# Altium project PA_8CH_CTRL.PrjPcb (part 1 of 3)
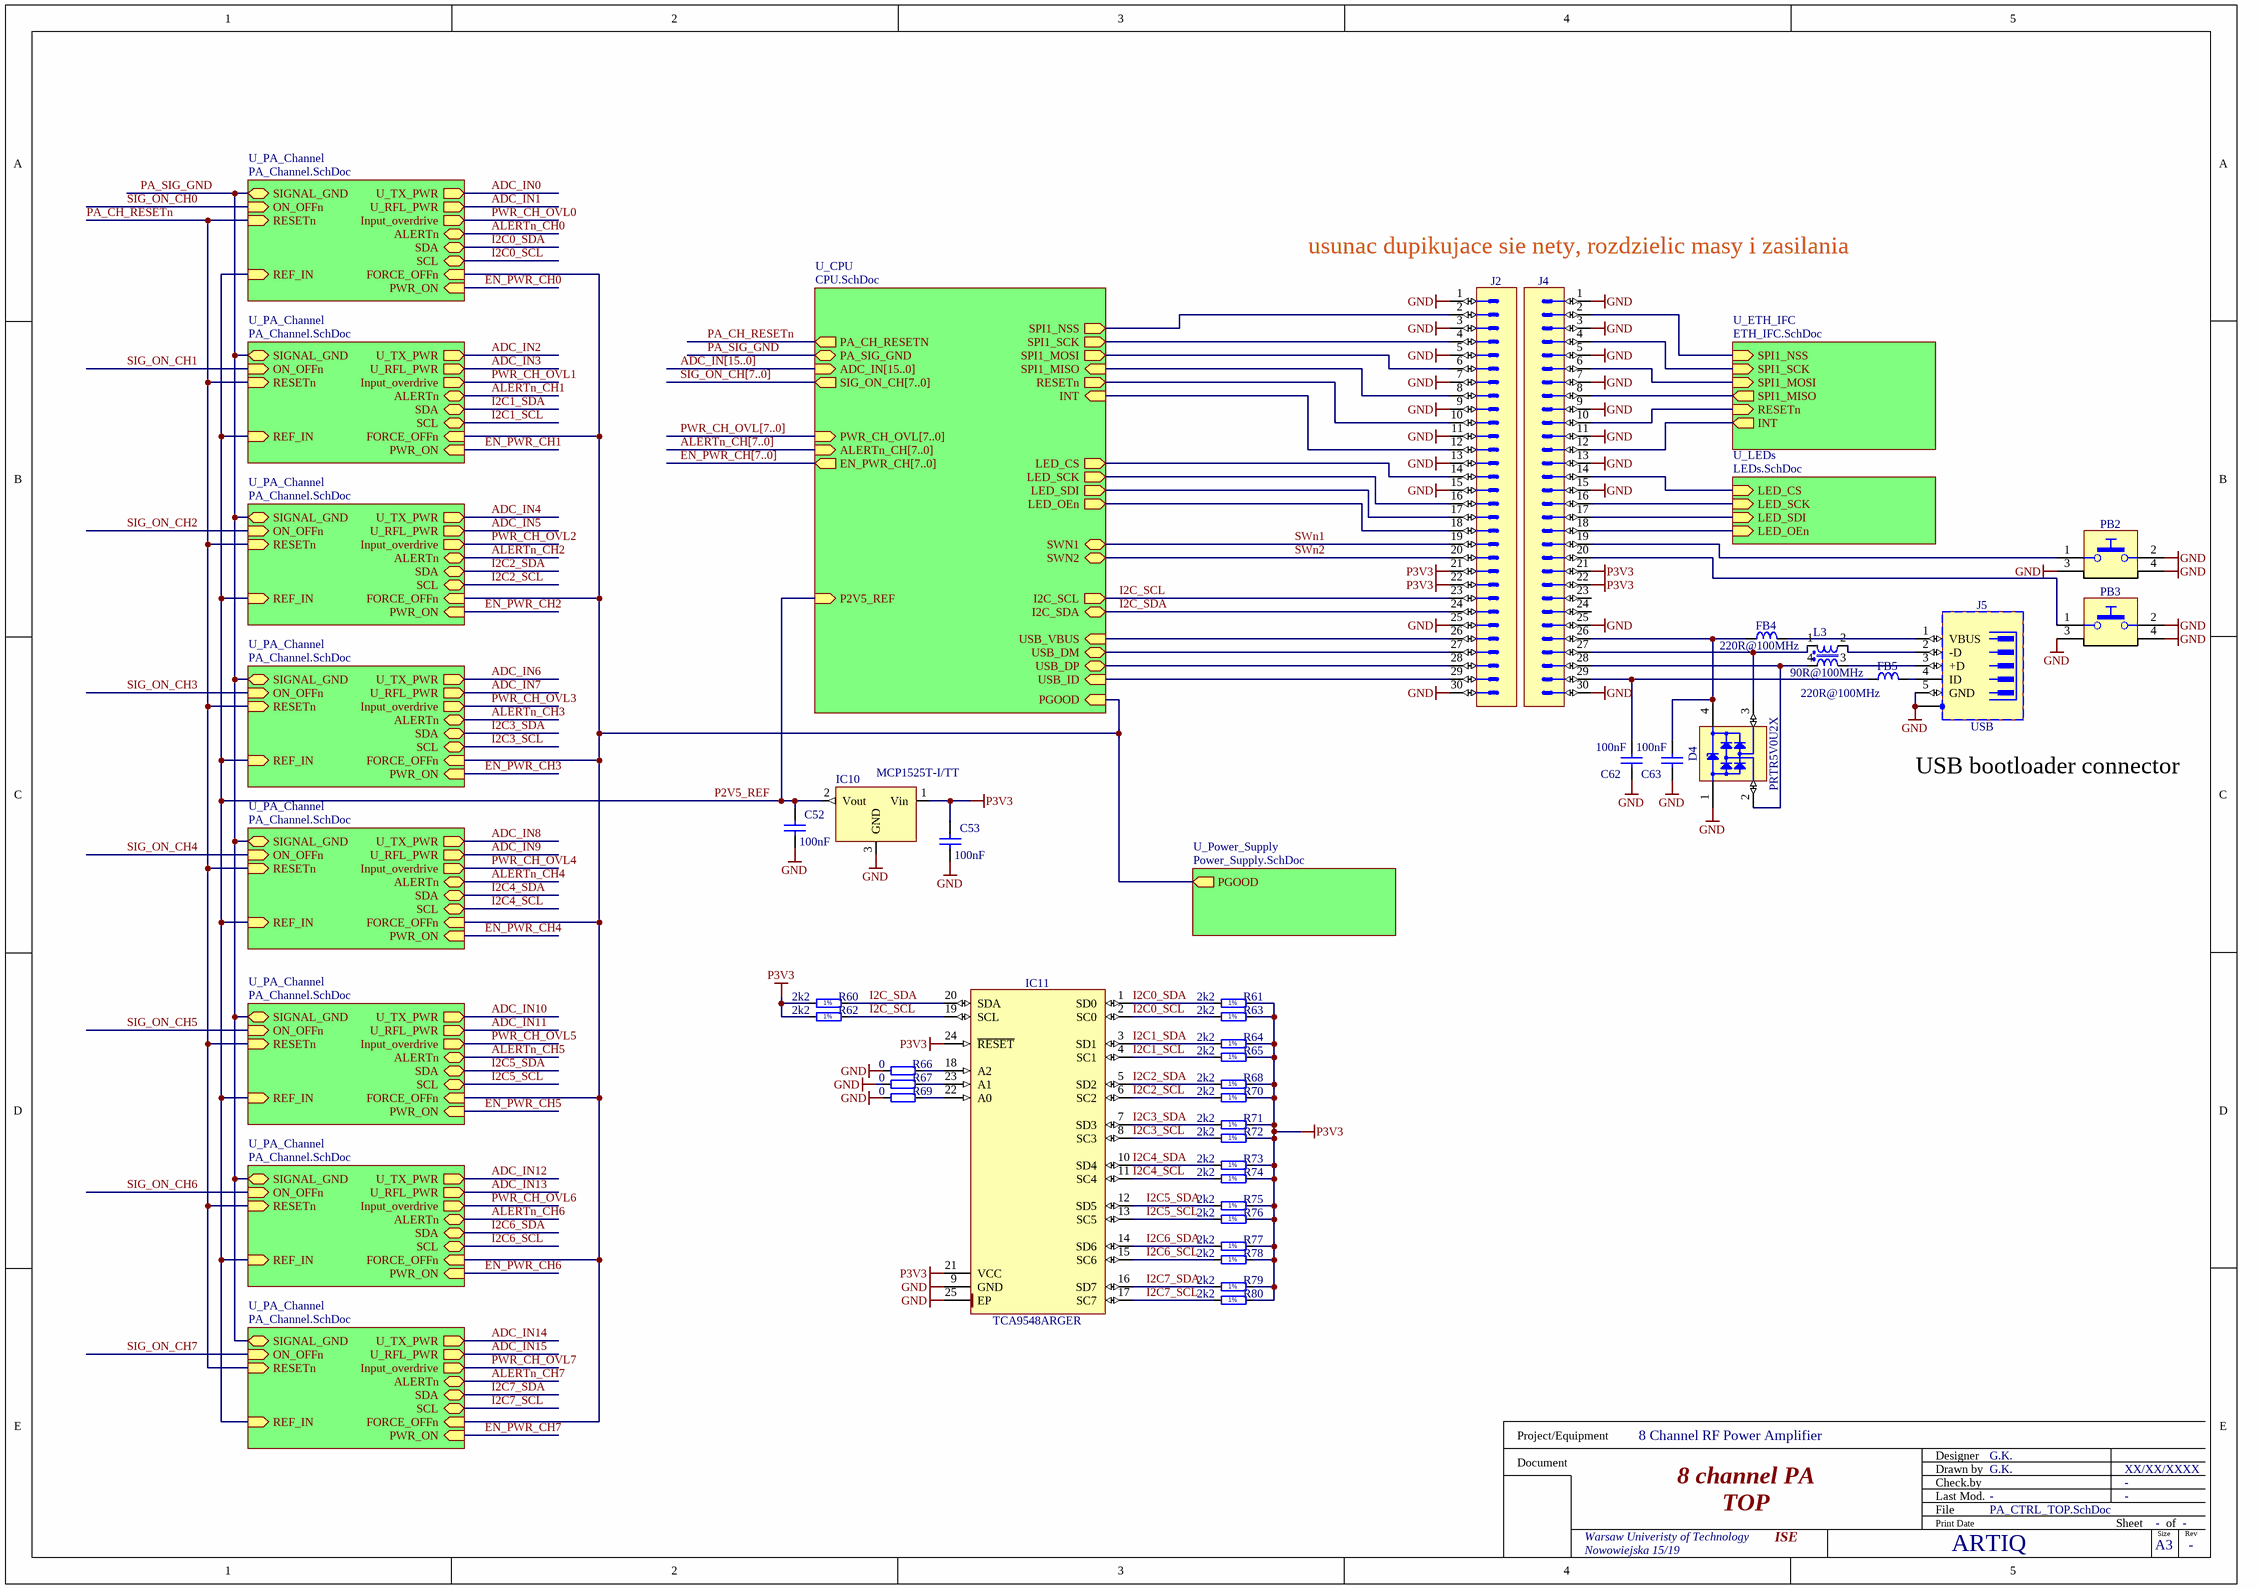
[diagram p0: PA_CTRL_TOP.SchDoc]
6 sheets, 762 parts. Net scope: hierarchical (ports join the sheet entries above them; power ports are global).
Board file: PA_8CH_CTRL.PcbDoc
Sheets:
  PA_CTRL_TOP.SchDoc
    U_ETH_IFC = ETH_IFC.SchDoc
    U_CPU = CPU.SchDoc
    U_PA_Channel = PA_Channel.SchDoc
    U_PA_Channel = PA_Channel.SchDoc
    U_PA_Channel = PA_Channel.SchDoc
    U_PA_Channel = PA_Channel.SchDoc
    U_PA_Channel = PA_Channel.SchDoc
    U_PA_Channel = PA_Channel.SchDoc
    U_PA_Channel = PA_Channel.SchDoc
    U_PA_Channel = PA_Channel.SchDoc
    U_LEDs = LEDs.SchDoc
    U_Power_Supply = Power_Supply.SchDoc

## Sheet PA_CTRL_TOP.SchDoc: 8 channel PA
size 420 x 297 mm; Author: G.K.; CompanyName: WUT; DrawnBy: G.K.; Organization: WUT ISE; Address1: Warsaw Univeristy of Technology; Address2: Nowowiejska 15/19; Revision: -; SheetNumber: -; SheetTotal: -; EDA_Number: ARTIQ; Projet: 8 Channel RF Power Amplifier; ModifiedBy: -; CreateDate: XX/XX/XXXX; CheckedDate: -; Title2: TOP; DivGrp: ISE; Designer: G.K.; ModifiedDate: -; ProjectName: 8 Channel RF Power Amplifier

### Parts
C52  100nF  [CAPC1005X55N]
C53  100nF  [CAPC1005X55N]
C62  100nF  [CAPC0603X33N]
C63  100nF  [CAPC0603X33N]
D4  PRTR5V0U2X  [SOT190P230X110-4N]
FB4  220R@100MHz  [INDC2012X105N]
FB5  220R@100MHz  [INDC2012X105N]
IC10  MCP1525T-I/TT  [SOT95P251X112-3N]
IC11  TCA9548ARGER  [QFN50P400X400X100-25N-S220]
J2  (no value)  [3M_N2530-6002RB]
J4  (no value)  [3M_N2530-6002RB]
J5  USB  [WURTH_651005136521]
L3  90R@100MHz  [IND_MURATA_DLW21S]
PB2  Push Button  [PB_TYCO_1-1825027-1]  (value not drawn)
PB3  Push Button  [PB_TYCO_1-1825027-1]  (value not drawn)
R60  2k2  [RESC1005X40N]
R61  2k2  [RESC1005X40N]
R62  2k2  [RESC1005X40N]
R63  2k2  [RESC1005X40N]
R64  2k2  [RESC1005X40N]
R65  2k2  [RESC1005X40N]
R66  0  [RESC1005X40N]
R67  0  [RESC1005X40N]
R68  2k2  [RESC1005X40N]
R69  0  [RESC1005X40N]
R70  2k2  [RESC1005X40N]
R71  2k2  [RESC1005X40N]
R72  2k2  [RESC1005X40N]
R73  2k2  [RESC1005X40N]
R74  2k2  [RESC1005X40N]
R75  2k2  [RESC1005X40N]
R76  2k2  [RESC1005X40N]
R77  2k2  [RESC1005X40N]
R78  2k2  [RESC1005X40N]
R79  2k2  [RESC1005X40N]
R80  2k2  [RESC1005X40N]

### Sub-sheets
U_CPU = CPU.SchDoc: ADC_IN[15..0] (in), SIG_ON_CH[7..0] (out), PWR_CH_OVL[7..0] (in), ALERTn_CH[7..0] (in), SPI1_NSS (out), SPI1_SCK (out), SPI1_MOSI (out), SPI1_MISO (in), RESETn (out), INT (in), LED_CS (out), LED_SCK (out), LED_SDI (out), LED_OEn (out), I2C_SCL (out), I2C_SDA (bidir), P2V5_REF (in), USB_DP (bidir), USB_ID (in), USB_DM (bidir), USB_VBUS (in), PA_SIG_GND (bidir), PA_CH_RESETN (out), PGOOD (in), EN_PWR_CH[7..0] (out), SWN1 (bidir), SWN2 (bidir)
U_ETH_IFC = ETH_IFC.SchDoc: SPI1_NSS (in), SPI1_SCK (in), SPI1_MOSI (in), SPI1_MISO (out), INT (out), RESETn (in)
U_LEDs = LEDs.SchDoc: LED_CS (in), LED_SCK (in), LED_SDI (in), LED_OEn (in)
U_PA_Channel = PA_Channel.SchDoc: U_TX_PWR (out), U_RFL_PWR (out), SIGNAL_GND (bidir), SDA (bidir), SCL (bidir), ON_OFFn (in), Input_overdrive (out), ALERTn (bidir), RESETn (in), REF_IN (in), PWR_ON (in), FORCE_OFFn (in)
U_PA_Channel = PA_Channel.SchDoc: U_TX_PWR (out), U_RFL_PWR (out), SIGNAL_GND (bidir), SDA (bidir), SCL (bidir), ON_OFFn (in), Input_overdrive (out), ALERTn (bidir), RESETn (in), REF_IN (in), PWR_ON (in), FORCE_OFFn (in)
U_PA_Channel = PA_Channel.SchDoc: U_TX_PWR (out), U_RFL_PWR (out), SIGNAL_GND (bidir), SDA (bidir), SCL (bidir), ON_OFFn (in), Input_overdrive (out), ALERTn (bidir), RESETn (in), REF_IN (in), PWR_ON (in), FORCE_OFFn (in)
U_PA_Channel = PA_Channel.SchDoc: U_TX_PWR (out), U_RFL_PWR (out), SIGNAL_GND (bidir), SDA (bidir), SCL (bidir), ON_OFFn (in), Input_overdrive (out), ALERTn (bidir), RESETn (in), REF_IN (in), PWR_ON (in), FORCE_OFFn (in)
U_PA_Channel = PA_Channel.SchDoc: U_TX_PWR (out), U_RFL_PWR (out), SIGNAL_GND (bidir), SDA (bidir), SCL (bidir), ON_OFFn (in), Input_overdrive (out), ALERTn (bidir), RESETn (in), REF_IN (in), PWR_ON (in), FORCE_OFFn (in)
U_PA_Channel = PA_Channel.SchDoc: U_TX_PWR (out), U_RFL_PWR (out), SIGNAL_GND (bidir), SDA (bidir), SCL (bidir), ON_OFFn (in), Input_overdrive (out), ALERTn (bidir), RESETn (in), REF_IN (in), PWR_ON (in), FORCE_OFFn (in)
U_PA_Channel = PA_Channel.SchDoc: U_TX_PWR (out), U_RFL_PWR (out), SIGNAL_GND (bidir), SDA (bidir), SCL (bidir), ON_OFFn (in), Input_overdrive (out), ALERTn (bidir), RESETn (in), REF_IN (in), PWR_ON (in), FORCE_OFFn (in)
U_PA_Channel = PA_Channel.SchDoc: U_TX_PWR (out), U_RFL_PWR (out), SIGNAL_GND (bidir), SDA (bidir), SCL (bidir), ON_OFFn (in), Input_overdrive (out), ALERTn (bidir), RESETn (in), REF_IN (in), PWR_ON (in), FORCE_OFFn (in)
U_Power_Supply = Power_Supply.SchDoc: PGOOD (out)

### Nets
GND: C52.2 C53.2 C62.1 C63.1 D4.1(GND) IC10.3(GND) IC11.9(GND) IC11.25(EP) J2.1 J2.3 J2.5 J2.7 J2.9 J2.11 J2.13 J2.15 J2.25 J2.30 J4.1 J4.3 J4.5 J4.7 J4.9 J4.11 J4.13 J4.15 J4.25 J4.30 J5.5(GND) J5.6(SH) PB2.2 PB2.3 PB2.4 PB3.2 PB3.3 PB3.4 R66.1 R67.1 R69.1
P3V3: C53.1 IC10.1(Vin) IC11.21(VCC) IC11.24(~{RESET}) J2.21 J2.22 J4.21 J4.22 R60.1 R61.2 R62.1 R63.2 R64.2 R65.2 R68.2 R70.2 R71.2 R72.2 R73.2 R74.2 R75.2 R76.2 R77.2 R78.2 R79.2 R80.2
I2C0_SCL: IC11.2(SC0) R63.1 ; sheet U_PA_Channel/SCL
I2C0_SDA: IC11.1(SD0) R61.1 ; sheet U_PA_Channel/SDA
I2C1_SCL: IC11.4(SC1) R65.1 ; sheet U_PA_Channel/SCL
I2C1_SDA: IC11.3(SD1) R64.1 ; sheet U_PA_Channel/SDA
I2C2_SCL: IC11.6(SC2) R70.1 ; sheet U_PA_Channel/SCL
I2C2_SDA: IC11.5(SD2) R68.1 ; sheet U_PA_Channel/SDA
I2C3_SCL: IC11.8(SC3) R72.1 ; sheet U_PA_Channel/SCL
I2C3_SDA: IC11.7(SD3) R71.1 ; sheet U_PA_Channel/SDA
I2C4_SCL: IC11.11(SC4) R74.1 ; sheet U_PA_Channel/SCL
I2C4_SDA: IC11.10(SD4) R73.1 ; sheet U_PA_Channel/SDA
I2C5_SCL: IC11.13(SC5) R76.1 ; sheet U_PA_Channel/SCL
I2C5_SDA: IC11.12(SD5) R75.1 ; sheet U_PA_Channel/SDA
I2C6_SCL: IC11.15(SC6) R78.1 ; sheet U_PA_Channel/SCL
I2C6_SDA: IC11.14(SD6) R77.1 ; sheet U_PA_Channel/SDA
I2C7_SCL: IC11.17(SC7) R80.1 ; sheet U_PA_Channel/SCL
I2C7_SDA: IC11.16(SD7) R79.1 ; sheet U_PA_Channel/SDA
I2C_SCL: IC11.19(SCL) J2.23 R62.2 ; sheet U_CPU/I2C_SCL
I2C_SDA: IC11.20(SDA) J2.24 R60.2 ; sheet U_CPU/I2C_SDA
INT: J4.12 ; sheet U_ETH_IFC/INT
LED_CS: J4.14 ; sheet U_LEDs/LED_CS
LED_OEn: J4.18 ; sheet U_LEDs/LED_OEn
LED_SCK: J4.16 ; sheet U_LEDs/LED_SCK
LED_SDI: J4.17 ; sheet U_LEDs/LED_SDI
P2V5_REF: C52.1 IC10.2(Vout) ; sheet U_CPU/P2V5_REF, sheet U_PA_Channel/REF_IN, sheet U_PA_Channel/REF_IN, sheet U_PA_Channel/REF_IN, sheet U_PA_Channel/REF_IN, sheet U_PA_Channel/REF_IN, sheet U_PA_Channel/REF_IN, sheet U_PA_Channel/REF_IN, sheet U_PA_Channel/REF_IN
PA_CH_RESETn: sheet U_CPU/PA_CH_RESETN, sheet U_PA_Channel/RESETn, sheet U_PA_Channel/RESETn, sheet U_PA_Channel/RESETn, sheet U_PA_Channel/RESETn, sheet U_PA_Channel/RESETn, sheet U_PA_Channel/RESETn, sheet U_PA_Channel/RESETn, sheet U_PA_Channel/RESETn
PA_SIG_GND: sheet U_CPU/PA_SIG_GND, sheet U_PA_Channel/SIGNAL_GND, sheet U_PA_Channel/SIGNAL_GND, sheet U_PA_Channel/SIGNAL_GND, sheet U_PA_Channel/SIGNAL_GND, sheet U_PA_Channel/SIGNAL_GND, sheet U_PA_Channel/SIGNAL_GND, sheet U_PA_Channel/SIGNAL_GND, sheet U_PA_Channel/SIGNAL_GND
RESETn: J4.10 ; sheet U_ETH_IFC/RESETn
SPI1_MISO: J4.8 ; sheet U_ETH_IFC/SPI1_MISO
SPI1_MOSI: J4.6 ; sheet U_ETH_IFC/SPI1_MOSI
SPI1_NSS: J4.2 ; sheet U_ETH_IFC/SPI1_NSS
SPI1_SCK: J4.4 ; sheet U_ETH_IFC/SPI1_SCK
SWn1: J2.19 ; sheet U_CPU/SWN1
SWn2: J2.20 ; sheet U_CPU/SWN2
NetC62_2: C62.2 FB5.1 J4.29
NetC63_2: C63.2 D4.4(VCC) FB4.1 J4.26
NetD2_1_1: sheet U_CPU/PGOOD, sheet U_PA_Channel/FORCE_OFFn, sheet U_PA_Channel/FORCE_OFFn, sheet U_PA_Channel/FORCE_OFFn, sheet U_PA_Channel/FORCE_OFFn, sheet U_PA_Channel/FORCE_OFFn, sheet U_PA_Channel/FORCE_OFFn, sheet U_PA_Channel/FORCE_OFFn, sheet U_PA_Channel/FORCE_OFFn, sheet U_Power_Supply/PGOOD
NetD4_2: D4.2(I/O1) J4.28 L3.4
NetD4_3: D4.3(I/O2) J4.27 L3.1
NetFB4_2: FB4.2 J5.1(VBUS)
NetFB5_2: FB5.2 J5.4(ID)
NetIC1_40: J2.2 ; sheet U_CPU/SPI1_NSS
NetIC1_41: J2.4 ; sheet U_CPU/SPI1_SCK
NetIC1_42: J2.8 ; sheet U_CPU/SPI1_MISO
NetIC1_43: J2.6 ; sheet U_CPU/SPI1_MOSI
NetIC1_73: J2.14 ; sheet U_CPU/LED_CS
NetIC1_74: J2.16 ; sheet U_CPU/LED_SCK
NetIC1_76: J2.17 ; sheet U_CPU/LED_SDI
NetIC1_90: J2.10 ; sheet U_CPU/RESETn
NetIC1_91: J2.12 ; sheet U_CPU/INT
NetIC1_102: J2.29 ; sheet U_CPU/USB_ID
NetIC1_103: J2.27 ; sheet U_CPU/USB_DM
NetIC1_104: J2.28 ; sheet U_CPU/USB_DP
NetIC1_139: J2.18 ; sheet U_CPU/LED_OEn
NetIC11_18: IC11.18(A2) R66.2
NetIC11_22: IC11.22(A0) R69.2
NetIC11_23: IC11.23(A1) R67.2
NetJ2_26: J2.26 ; sheet U_CPU/USB_VBUS
NetJ4_19: J4.19 PB2.1
NetJ4_20: J4.20 PB3.1
NetJ5_2: J5.2(-D) L3.2
NetJ5_3: J5.3(+D) L3.3

Not connected (* = marked no-connect by the designer): J4 23 24

### Buses and harness runs
bus ADC_IN[15..0] = sheet U_CPU/ADC_IN[15..0]
bus ALERTn_CH[7..0] = sheet U_CPU/ALERTn_CH[7..0]
bus EN_PWR_CH[7..0] = sheet U_CPU/EN_PWR_CH[7..0]
bus PWR_CH_OVL[7..0] = sheet U_CPU/PWR_CH_OVL[7..0]
bus SIG_ON_CH[7..0] = sheet U_CPU/SIG_ON_CH[7..0]

### Notes on the sheet
- usunac dupikujace sie nety, rozdzielic masy i zasilania
- (near J5) USB bootloader connector
- Project/Equipment
- Document
- Designer
- Drawn by
- Check.by
- File
- Last Mod.
- Print Date
- Sheet
- Size
- A3
- of
- Rev
- (in symbol R0402_2K2_1%_0.0625W_100PPM) 1%

### Library data of the parts
C52 C53 = CC0402_100NF_16V_10%_X7R: Non-polarised capacitor; Part Description: SMD Multilayer Chip Ceramic Capacitor; Manufacturer: GENERIC; Manufacturer1 Part Number: GRM155R71C104KA88D; Voltage: 16V; TC: X7R; Tolerance: ±10%; Table: Capacitors SMD; Part Number: CC0402_100NF_16V_10%_X7R; Component Kind: Standard; Component Type: Standard; Pin Count: 2; Value: 100nF; Status: Not Recommended; Manufacturer Part Number: CC0402_100NF_16V_10%_X7R; Case: 0402; Mounted: Yes; Socket: No; SMD: Yes; Manufacturer1 Example: MURATA; Manufacturer1 ComponentHeight: 0.55mm; HelpURL: \\cern.ch\dfs\Applications\Altium\Datasheets\CC0402_X7R_MURATA_GRM.pdf; Author: CERN DEM JLC; CreateDate: 2013-12-05; LatestRevisionDate: 2007-12-03
C62 C63 = CC0201_100NF_6.3V_10%_X5R: Non-polarised capacitor; Part Description: SMD Multilayer Chip Ceramic Capacitor; Manufacturer: GENERIC; Manufacturer1 Part Number: 02016D104KAT2A; Voltage: 6.3V; TC: X5R; Tolerance: ±10%; Table: Capacitors SMD; Part Number: CC0201_100NF_6.3V_10%_X5R; Component Kind: Standard; Component Type: Standard; Pin Count: 2; Value: 100nF; Status: Not Recommended; Manufacturer Part Number: CC0201_100NF_6.3V_10%_X5R; Case: 0201; Mounted: Yes; Socket: No; SMD: Yes; Manufacturer1 Example: AVX; Manufacturer1 ComponentHeight: 0.33mm; HelpURL: \\cern.ch\dfs\Applications\Altium\Datasheets\CC0201_X5R_AVX.pdf; Author: CERN DEM JLC; CreateDate: 2007-12-03; LatestRevisionDate: 2007-12-03
D4 = PRTR5V0U2X: Ultra Low Capacitance Double Rail-to-Rail ESD Protection Diode; Part Description: Ultra Low Capacitance (1pF) Double Rail-to-Rail ESD Protection Diode (8kV); Manufacturer: NXP SEMICONDUCTORS; Voltage: 5.5V; PressFit: No; Bonding: No; Part Number: PRTR5V0U2X; Component Kind: Standard; Component Type: Standard; Device: PRTR5V0U2X; PackageDescription: SOT143B, SOT, 1.90mm Pitch; 4 Pin, 1.30mm W X 2.90mm L X 1.10mm H body, IPC Medium Density; Manufacturer Part Number: PRTR5V0U2X; Pin Count: 4; Case: SOT143B; Mounted: Yes; Socket: No; SMD: Yes; Sense: No; ComponentHeight: 1.1mm; HelpURL: \\cern.ch\dfs\Applications\Altium\Datasheets\PRTR5V0U2X.pdf; Author: CERN DEM JLC; CreateDate: 22.03.2011; LatestRevisionDate: 22.03.2011
FB4 FB5 = IND0805_MURATA_BLM21PG221SN1D: Inductor; Part Description: SMD EMIFIL Suppression Chip Ferrite Bead; Manufacturer: MURATA; Power: 2A; Resistance: 0.05R; Tolerance: ±25%; Table: Inductors SMD; Part Number: IND0805_MURATA_BLM21PG221SN1D; Component Kind: Standard; Component Type: Standard; Pin Count: 2; Value: 220R@100MHz; Status: None; Manufacturer Part Number: BLM21PG221SN1D; Case: 0805; Mounted: Yes; Socket: No; SMD: Yes; ComponentHeight: 1.05mm; HelpURL: \\cern.ch\dfs\Applications\Altium\Datasheets\IND0402_MURATA_BLM21P.pdf; Author: CERN DEM JLC; CreateDate: 2010-01-25; LatestRevisionDate: 2010-01-25
IC10 = REF_MCP1525: 2.5 voltage reference
IC11 = TCA9548ARGER: Low Voltage 8-Channel I2C Switch With Reset; Manufacturer: TEXAS INSTRUMENTS; PressFit: No; Bonding: No; Part Number: TCA9548ARGER; Component Kind: Standard; Component Type: Standard; Device: TCA9548ARGER; PackageDescription: QFN, 0.50mm Pitch, Square; 24 Pin, 4.00mm L X 4.00mm W X 1.00mm H body (w/thermal tab 2.2 X 2.2mm), IPC Medium Density; Part Description: Low Voltage 8-Channel I2C Switch With Reset; Manufacturer Part Number: TCA9548ARGER; Pin Count: 25; Case: QFN24; Mounted: Yes; Socket: No; SMD: Yes; Sense: No; ComponentHeight: 1mm; Author: CERN DEM JLC; HelpURL: \\cern.ch\dfs\Applications\Altium\Datasheets\TCA9548ARGER.pdf; CreateDate: 07.07.2014; LatestRevisionDate: 07.07.2014
J2 J4 = 3M_N2530-6002RB: Connector 30 Male; Part Description: 30 Contacts - Straight .100'' x .100'' Low Profile Four-Wall Header, 2500 Series; Manufacturer: 3M; PressFit: No; Part Number: 3M_N2530-6002RB; Component Kind: Standard; Component Type: Standard; Pin Count: 30; Family: Header 30; Mounted: Yes; Socket: No; SMD: No; Sense: No; Status: None; Manufacturer Part Number: N2530-6002RB; ComponentHeight: 10.03mm; HelpURL: \\cern.ch\dfs\Applications\Altium\Datasheets\3M_N2530-6002RB.pdf; Author: CERN DEM JLC; CreateDate: 11.02.2009; LatestRevisionDate: 11.08.2009
J5 = WURTH_651005136521: 5 Pin + 1 Shield USB Receptacle; Part Description: Mini USB Type B  Receptacle, Horizontal, 5 Contacts; Manufacturer: WURTH ELEKTRONIK; PressFit: No; Part Number: WURTH_651005136521; Component Kind: Standard; Component Type: Standard; Pin Count: 6; Family: USB; Mounted: Yes; Socket: No; SMD: No; Sense: No; Status: None; Manufacturer Part Number: 651005136521; ComponentHeight: 3.9mm; HelpURL: \\cern.ch\dfs\Applications\Altium\Datasheets\WURTH_651005136521.pdf; Author: CERN DEM JLC; CreateDate: 07.03.2011; LatestRevisionDate: 07.03.2011
L3 = IND_MURATA_DLW21SN900SQ2L: Inductor Common Mode; Part Description: Wire Wound Common Mode Choke Coil (DLW21S Series); Manufacturer: MURATA; Power: 330mA; Resistance: 0.35R; Tolerance: ±25%; Part Number: IND_MURATA_DLW21SN900SQ2L; Component Kind: Standard; Component Type: Standard; Pin Count: 4; Value: 90R@100MHz; Status: None; Manufacturer Part Number: DLW21SN900SQ2L; Case: 0805; Mounted: Yes; Socket: No; SMD: Yes; Sense: No; ComponentHeight: 1.4mm; HelpURL: \\cern.ch\dfs\Applications\Altium\Datasheets\IND_MURATA_DLW21S.pdf; Author: CERN DEM JLC; CreateDate: 01.07.2014; LatestRevisionDate: 01.07.2014
PB2 PB3 = PB_TYCO_1-1825027-1: Push-Button Switch SPDT; Part Description: Right Angle Micro Miniature Tactile Pushbutton Switch, Round Actuator Length = 5.74mm, FSMRAJ Serie; Manufacturer: TYCO ELECTRONICS; PressFit: No; Part Number: PB_TYCO_1-1825027-1; Component Kind: Standard; Component Type: Standard; Pin Count: 4; PackageDescription: Right Angle Micro Miniature Tactile Pushbutton Switch, Round Actuator Length = 5.74mm, FSMRAJ Serie; Family: Push Button; Mounted: Yes; Socket: No; SMD: No; Sense: No; Status: None; Manufacturer Part Number: 1-1825027-1; ComponentHeight: 7.01mm; HelpURL: \\cern.ch\dfs\Applications\Altium\Datasheets\PB_TYCO_1-1825027-1.pdf; Author: CERN DEM JLC; CreateDate: 17.04.2013; LatestRevisionDate: 28.10.2013
R60-R65 R68 R70-R80 = R0402_2K2_1%_0.0625W_100PPM: Resistor - 1%; Part Description: General Purpose Thick Film Chip Resistor; Manufacturer: GENERIC; Manufacturer1 Part Number: 232270672202L; TC: ±100ppm/°C; Part Number: R0402_2K2_1%_0.0625W_100PPM; Component Kind: Standard; Component Type: Standard; Pin Count: 2; Value: 2k2; Status: Not recommended; Power: 0.0625W; Tolerance: ±1%; Manufacturer Part Number: R0402_2K2_1%_0.0625W_100PPM; Case: 0402; Mounted: Yes; Sense: No; Socket: No; SMD: Yes; Manufacturer1 Example: YAGEO PHYCOMP; Manufacturer1 ComponentHeight: 0.4mm; HelpURL: \\cern.ch\dfs\Applications\Altium\Datasheets\R0402_Phycomp_RC0402.pdf; Author: CERN DEM JLC; CreateDate: 03.12.2007; LatestRevisionDate: 17.10.2012
R66 R67 R69 = R0402_0R_JUMPER: Resistor; Part Description: 1A (0.05R Max DC Resistance) Zero Ohm Jumper; Manufacturer: GENERIC; Manufacturer1 Part Number: 232270591001L; Part Number: R0402_0R_JUMPER; Component Kind: Standard; Component Type: Standard; Pin Count: 2; Value: 0; Status: Not recommended; Manufacturer Part Number: R0402_0R_JUMPER; Case: 0402; Mounted: Yes; Sense: No; Socket: No; SMD: Yes; Manufacturer1 Example: YAGEO PHYCOMP; Manufacturer1 ComponentHeight: 0.4mm; HelpURL: \\cern.ch\dfs\Applications\Altium\Datasheets\R0402_Phycomp_RC0402.pdf; Author: CERN DEM JLC; CreateDate: 03.12.2007; LatestRevisionDate: 17.10.2012

## Sheet ETH_IFC.SchDoc
size A3
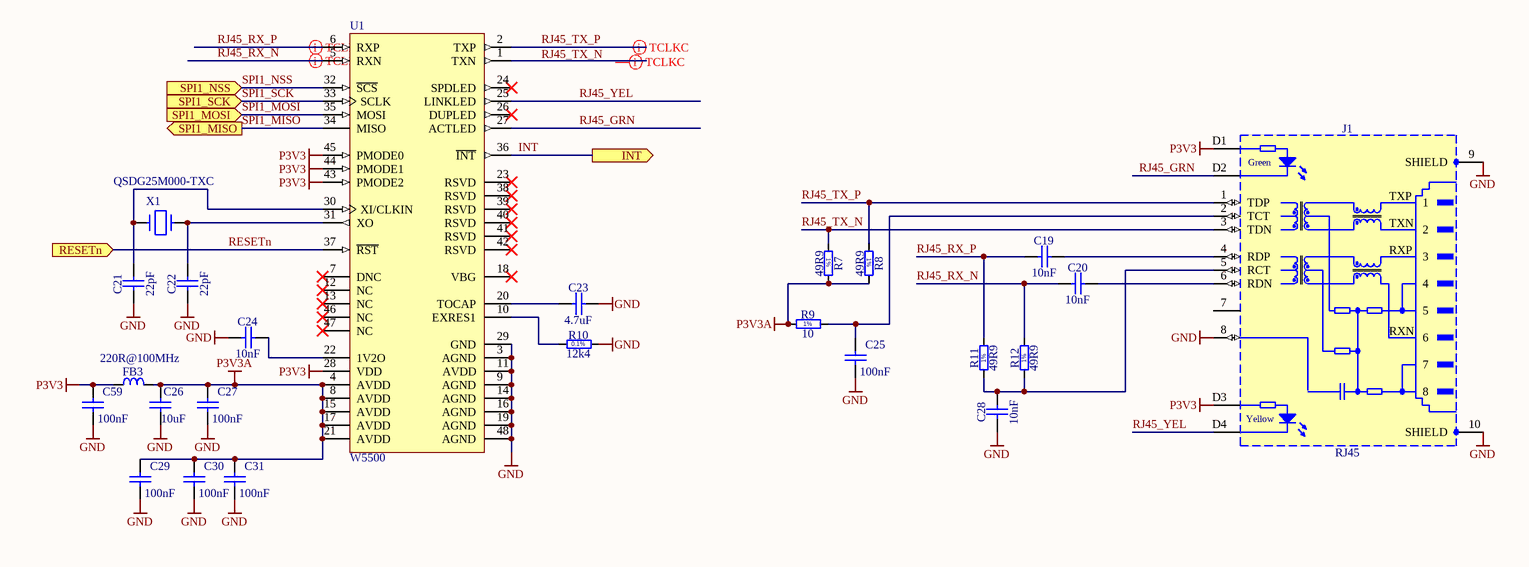
[diagram p1: ETH_IFC.SchDoc]

### Parts
C19  10nF  [CAPC1608X87N]
C20  10nF  [CAPC1608X87N]
C21  22pF  [CAPC1005X55N]
C22  22pF  [CAPC1005X55N]
C23  4.7uF  [CAPC1709X95N]
C24  10nF  [CAPC1608X87N]
C25  100nF  [CAPC0603X33N]
C26  10uF  [CAPC2012X135N]
C27  100nF  [CAPC0603X33N]
C28  10nF  [CAPC1608X87N]
C29  100nF  [CAPC0603X33N]
C30  100nF  [CAPC0603X33N]
C31  100nF  [CAPC0603X33N]
C59  100nF  [CAPC0603X33N]
FB3  220R@100MHz  [INDC2012X105N]
J1  RJ45  [TYCO_5-6605308-1]
R7  49R9  [RESC1005X40N]
R8  49R9  [RESC1005X40N]
R9  10  [RESC1005X40N]
R10  12k4  [RESC1608X55N]
R11  49R9  [RESC1005X40N]
R12  49R9  [RESC1005X40N]
U1  W5500  [WIZ-W5500-LQFP-48_M]
X1  QSDG25M000-TXC  [XTAL_5.0*3.2]

### Ports
INT (out), RESETn (in), SPI1_MISO (out), SPI1_MOSI (in), SPI1_NSS (in), SPI1_SCK (in)

### Nets
GND: C21.1 C22.1 C23.2 C24.1 C25.2 C26.2 C27.2 C28.1 C29.2 C30.2 C31.2 C59.2 J1.8 J1.9(SHIELD) J1.10(SHIELD) R10.2 U1.3(AGND) U1.9(AGND) U1.11(AVDD) U1.14(AGND) U1.16(AGND) U1.19(AGND) U1.29(GND) U1.48(AGND)
P3V3: C59.1 FB3.1 J1.D1 J1.D3 U1.28(VDD) U1.43(PMODE2) U1.44(PMODE1) U1.45(PMODE0)
P3V3A: C26.1 C27.1 C29.1 C30.1 C31.1 FB3.2 R7.2 R8.2 R9.1 U1.4(AVDD) U1.8(AVDD) U1.15(AVDD) U1.17(AVDD) U1.21(AVDD)
INT: U1.36(~{INT}) ; port INT
RESETn: U1.37(~{RST}) ; port RESETn
RJ45_GRN: J1.D2 U1.27(ACTLED)
RJ45_RX_N: C20.1 R12.2 U1.5(RXN)
RJ45_RX_P: C19.1 R11.2 U1.6(RXP)
RJ45_TX_N: J1.3(TDN) R7.1
RJ45_TX_P: J1.1(TDP) R8.1 U1.2(TXP)
RJ45_YEL: J1.D4 U1.25(LINKLED)
SPI1_MISO: U1.34(MISO) ; port SPI1_MISO
SPI1_MOSI: U1.35(MOSI) ; port SPI1_MOSI
SPI1_NSS: U1.32(~{SCS}) ; port SPI1_NSS
SPI1_SCK: U1.33(SCLK) ; port SPI1_SCK
NetC19_2: C19.2 J1.4(RDP)
NetC20_2: C20.2 J1.6(RDN)
NetC21_2: C21.2 U1.30(XI/CLKIN) X1.1
NetC22_2: C22.2 U1.31(XO) X1.2
NetC23_1: C23.1 U1.20(TOCAP)
NetC24_2: C24.2 U1.22(1V2O)
NetC25_1: C25.1 J1.2(TCT) R9.2
NetC28_2: C28.2 J1.5(RCT) R11.1 R12.1
NetR10_1: R10.1 U1.10(EXRES1)

Not connected (* = marked no-connect by the designer): J1 7; U1 1(TXN) 7(DNC)* 12(NC)* 13(NC)* 18(VBG)* 23(RSVD)* 24(SPDLED)* 26(DUPLED)* 38(RSVD)* 39(RSVD)* 40(RSVD)* 41(RSVD)* 42(RSVD)* 46(NC)* 47(NC)*

### Layout directives
differential pair: (no net found under the mark), RJ45_RX_N, RJ45_RX_P, RJ45_TX_P

### Notes on the sheet
- Labels drawn without touching a wire or pin: RJ45_TX_N
- (in symbol R0402_10R_1%_0.0625W_200PPM) 1%
- (in symbol R0402_49R9_1%_0.0625W_100PPM) 1%
- (in symbol R0603_12K4_0.1%_0.063W_10PPM) 0.1%
- (in symbol TYCO_5-6605308-1) Green; TXP; TXN; RXP; RXN; Yellow

### Library data of the parts
C19 C20 C24 C28 = CC0603_10NF_50V_5%_C0G: Non-polarised capacitor; Part Description: SMD Multilayer Chip Ceramic Capacitor; Manufacturer: GENERIC; Manufacturer1 Part Number: C1608C0G1H103J080AA; Voltage: 50V; TC: C0G/NP0; Tolerance: ±5%; Part Number: CC0603_10NF_50V_5%_C0G; Component Kind: Standard; Component Type: Standard; Pin Count: 2; Value: 10nF; Status: Preferred; Manufacturer Part Number: CC0603_10NF_50V_5%_C0G; Case: 0603; Mounted: Yes; Socket: No; SMD: Yes; Sense: No; Manufacturer1 Example: TDK; Manufacturer1 ComponentHeight: 0.9mm; HelpURL: \\cern.ch\dfs\Applications\Altium\Datasheets\CC0603_C0G_TDK_C.pdf; Author: CERN DEM JLC; CreateDate: 10.12.2014; LatestRevisionDate: 10.12.2014
C21 C22 = CC0402_22PF_50V_5%_NP0: Non-polarised capacitor; Part Description: SMD Multilayer Chip Ceramic Capacitor; Manufacturer: GENERIC; Manufacturer1 Part Number: 223886915229; Voltage: 50V; TC: NP0; Tolerance: ±5%; Table: Capacitors SMD; Part Number: CC0402_22PF_50V_5%_NP0; Component Kind: Standard; Component Type: Standard; Pin Count: 2; Value: 22pF; Status: Not Recommended; Manufacturer Part Number: CC0402_22PF_50V_5%_NP0; Case: 0402; Mounted: Yes; Socket: No; SMD: Yes; Manufacturer1 Example: PHYCOMP; Manufacturer1 ComponentHeight: 0.55mm; HelpURL: \\cern.ch\dfs\Applications\Altium\Datasheets\CC0402_NP0_PHYCOMP.pdf; Author: CERN DEM JLC; CreateDate: 2007-12-03; LatestRevisionDate: 2007-12-03
C23 = CC0603_4.7UF_16V_10%_X5R: Non-polarised capacitor; Part Description: SMD Multilayer Chip Ceramic Capacitor; Manufacturer: GENERIC; Manufacturer1 Part Number: EMK107ABJ475KA-T; Voltage: 16V; TC: X5R; Tolerance: ±10%; Part Number: CC0603_4.7UF_16V_10%_X5R; Component Kind: Standard; Component Type: Standard; Pin Count: 2; Value: 4.7uF; Status: None; Manufacturer Part Number: CC0603_4.7UF_16V_10%_X5R; Case: 0603; Mounted: Yes; Socket: No; SMD: Yes; Sense: No; Manufacturer1 Example: TAIYO YUDEN; Manufacturer1 ComponentHeight: 0.95mm; HelpURL: \\cern.ch\dfs\Applications\Altium\Datasheets\CC0603_X7R_TAIYO-YUDEN_HIGH-VALUE.pdf; Author: CERN DEM JLC; CreateDate: 16.12.2013; LatestRevisionDate: 16.09.2014
C25 C27 C29-C31 C59 = CC0201_100NF_6.3V_10%_X5R: as C62 on sheet PA_CTRL_TOP; Part Number: CC0201_100NF_6.3V_10%_X5R; Component Kind: Standard; Component Type: Standard; Pin Count: 2; Value: 100nF; Status: Not Recommended; Manufacturer Part Number: CC0201_100NF_6.3V_10%_X5R; Case: 0201; Mounted: Yes; Socket: No; SMD: Yes; Manufacturer1 Example: AVX; Manufacturer1 ComponentHeight: 0.33mm; HelpURL: \\cern.ch\dfs\Applications\Altium\Datasheets\CC0201_X5R_AVX.pdf; Author: CERN DEM JLC; CreateDate: 2007-12-03; LatestRevisionDate: 2007-12-03
C26 = CC0805_10UF_10V_10%_X7R: Non-polarised capacitor; Part Description: SMD Multilayer Chip Ceramic Capacitor; Manufacturer: GENERIC; Manufacturer1 Part Number: GRM21BR71A106KE51L; Voltage: 10V; TC: X7R; Tolerance: ±10%; Table: Capacitors SMD; Part Number: CC0805_10UF_10V_10%_X7R; Component Kind: Standard; Component Type: Standard; Pin Count: 2; Value: 10uF; Status: Preferred; Manufacturer Part Number: CC0805_10UF_10V_10%_X7R; Case: 0805; Mounted: Yes; Socket: No; SMD: Yes; Manufacturer1 Example: MURATA; Manufacturer1 ComponentHeight: 1.35mm; HelpURL: \\cern.ch\dfs\Applications\Altium\Datasheets\CC0805_X7R_MURATA.pdf; Author: CERN DEM JLC; CreateDate: 2012-04-30; LatestRevisionDate: 2012-04-30
FB3 = IND0805_MURATA_BLM21PG221SN1D: as FB4 on sheet PA_CTRL_TOP; Part Number: IND0805_MURATA_BLM21PG221SN1D; Component Kind: Standard; Component Type: Standard; Pin Count: 2; Value: 220R@100MHz; Status: None; Manufacturer Part Number: BLM21PG221SN1D; Case: 0805; Mounted: Yes; Socket: No; SMD: Yes; ComponentHeight: 1.05mm; HelpURL: \\cern.ch\dfs\Applications\Altium\Datasheets\IND0402_MURATA_BLM21P.pdf; Author: CERN DEM JLC; CreateDate: 2010-01-25; LatestRevisionDate: 2010-01-25
J1 = TYCO_5-6605308-1: 1 Port, Yellow/Green LEDs, RJ45 10/100Base-T Ethernet, Mag45 Connector Module With Integrated Magnetics; Manufacturer: TYCO ELECTRONICS; PressFit: No; Part Number: TYCO_5-6605308-1; Component Kind: Standard; Component Type: Standard; Pin Count: 14; Family: RJ45; Mounted: Yes; Socket: No; SMD: No; Sense: No; Status: None; Part Description: 1 Port, Yellow/Green LEDs, RJ45 10/100Base-T Ethernet, Mag45 Connector Module With Integrated Magnetics; Manufacturer Part Number: 5-6605308-1; ComponentHeight: 15.24mm; HelpURL: \\cern.ch\dfs\Applications\Altium\Datasheets\TYCO_5-6605308-1.pdf; Author: CERN DEM JLC; CreateDate: 23.08.2012; LatestRevisionDate: 23.08.2012
R7 R8 R11 R12 = R0402_49R9_1%_0.0625W_100PPM: Resistor - 1%; Part Description: General Purpose Thick Film Chip Resistor; Manufacturer: GENERIC; Manufacturer1 Part Number: 232270674999L or RC0402FR-0749R9L; TC: ±100ppm/°C; Table: Resistors SMD; Part Number: R0402_49R9_1%_0.0625W_100PPM; Component Kind: Standard; Component Type: Standard; Pin Count: 2; Value: 49R9; Status: Not recommended; Power: 0.0625W; Tolerance: ±1%; Manufacturer Part Number: R0402_49R9_1%_0.0625W_100PPM; Case: 0402; Mounted: Yes; Socket: No; SMD: Yes; Manufacturer1 Example: YAGEO PHYCOMP; Manufacturer1 ComponentHeight: 0.4mm; HelpURL: \\cern.ch\dfs\Applications\Altium\Datasheets\R0402_Phycomp_RC0402.pdf; Author: CERN DEM JLC; CreateDate: 2012-10-24; LatestRevisionDate: 2012-10-24
R9 = R0402_10R_1%_0.0625W_200PPM: Resistor - 1%; Part Description: General Purpose Thick Film Chip Resistor; Manufacturer: GENERIC; Manufacturer1 Part Number: 232270671009L; TC: ±200ppm/°C; Part Number: R0402_10R_1%_0.0625W_200PPM; Component Kind: Standard; Component Type: Standard; Pin Count: 2; Value: 10; Status: Not recommended; Power: 0.0625W; Tolerance: ±1%; Manufacturer Part Number: R0402_10R_1%_0.0625W_200PPM; Case: 0402; Mounted: Yes; Sense: No; Socket: No; SMD: Yes; Manufacturer1 Example: YAGEO PHYCOMP; Manufacturer1 ComponentHeight: 0.4mm; HelpURL: \\cern.ch\dfs\Applications\Altium\Datasheets\R0402_Phycomp_RC0402.pdf; Author: CERN DEM JLC; CreateDate: 24.06.2009; LatestRevisionDate: 17.10.2012
R10 = R0603_12K4_0.1%_0.063W_10PPM: Resistor - 0.1%; Part Description: Thin Film Chip Resistor; Manufacturer: GENERIC; Manufacturer1 Part Number: RN73C1J12K4BTDF; Power: 0.063W; TC: ±10ppm; Part Number: R0603_12K4_0.1%_0.063W_10PPM; Component Kind: Standard; Component Type: Standard; Pin Count: 2; Value: 12k4; Status: Not recommended; Tolerance: ±0.1%; Manufacturer Part Number: R0603_12K4_0.1%_0.063W_10PPM; Case: 0603; Mounted: Yes; Sense: No; Socket: No; SMD: Yes; Manufacturer1 Example: TYCO HOLSWORTHY; Manufacturer1 ComponentHeight: 0.5mm; HelpURL: \\cern.ch\dfs\Applications\Altium\Datasheets\R0603_Tyco_RN73.pdf; Author: CERN DEM JLC; CreateDate: 03.12.2007; LatestRevisionDate: 13.03.2008
U1 = CMP-1775-00001-1: Hardwired TCP/IP Embedded Ethernet Controller, 3.3 V, 25 MHz, -40 to 85 degC, 48-Pin LQFP, RoHS, Tray; ComponentLink1Description: Manufacturer URL; ComponentLink1URL: http://www.wiznet.co.kr/; PackageDescription: 48-Pin Low-profile Quad Flat Package, Body 7.00 x 7.00 mm, Pitch 0.50 mm; DatasheetVersion: Rev. 1.0.6, 12/2014; ComponentLink2Description: Datasheet; ComponentLink2URL: http://wizwiki.net/wiki/lib/exe/fetch.php?media=products:w5500:w5500_ds_v106e_141230.pdf; PackageReference: LQFP-48
X1 = X_CRYSTAL_SMD_5.0*3.2: miniature crystal oscillator (Maritex)

## Sheet CPU.SchDoc: CPU
size 420 x 297 mm; Author: G.K.; CompanyName: WUT; DrawnBy: G.K.; Organization: WUT ISE; Address1: Warsaw Univeristy of Technology; Address2: Nowowiejska 15/19; Revision: -; SheetNumber: -; SheetTotal: -; EDA_Number: ARTIQ; Projet: 8 Channel RF Power Amplifier; ModifiedBy: -; CreateDate: XX/XX/XXXX; CheckedDate: -; Title2: controller; DivGrp: ISE; Designer: G.K.; ModifiedDate: -; ProjectName: 8 Channel RF Power Amplifier
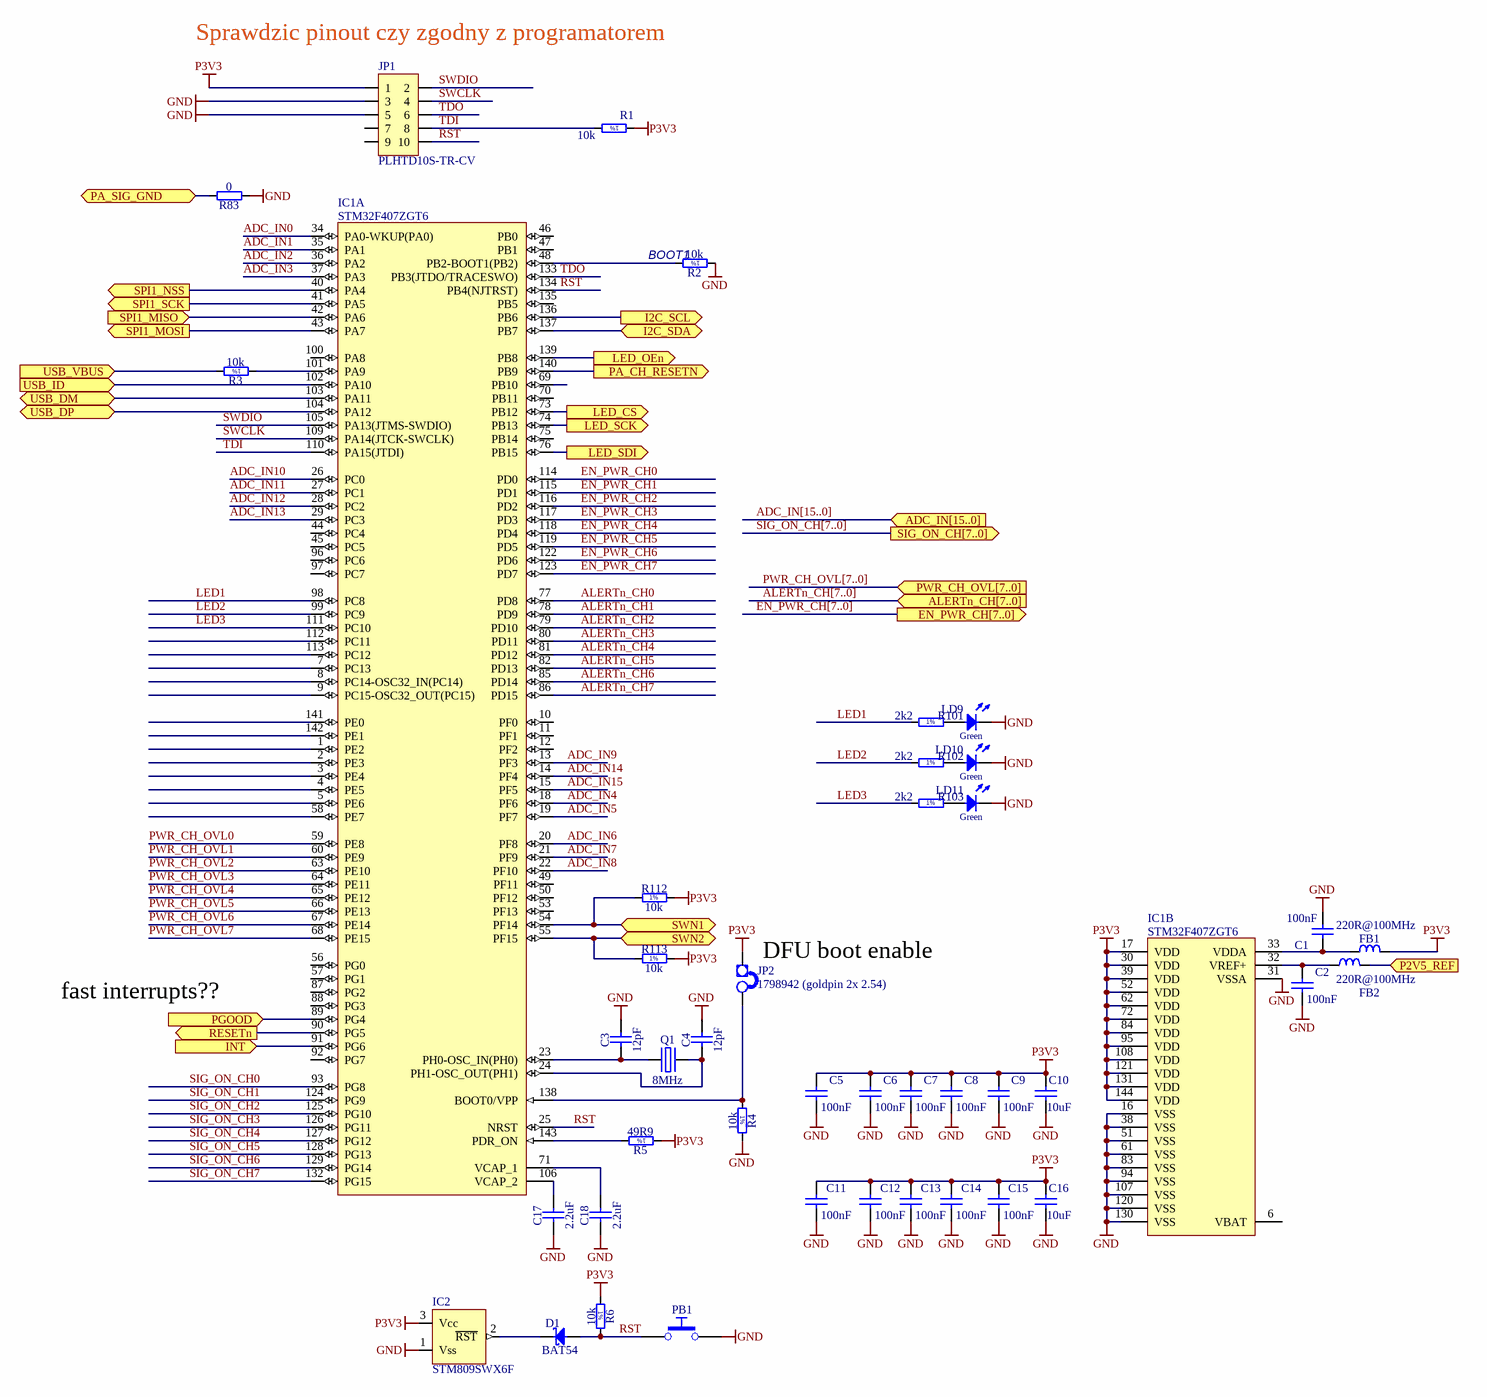
[diagram p2: CPU.SchDoc]

### Parts
C1  100nF  [CAPC0603X33N]
C2  100nF  [CAPC0603X33N]
C3  12pF  [CAPC1005X55N]
C4  12pF  [CAPC1005X55N]
C5  100nF  [CAPC0603X33N]
C6  100nF  [CAPC0603X33N]
C7  100nF  [CAPC0603X33N]
C8  100nF  [CAPC0603X33N]
C9  100nF  [CAPC0603X33N]
C10  10uF  [CAPC2012X135N]
C11  100nF  [CAPC0603X33N]
C12  100nF  [CAPC0603X33N]
C13  100nF  [CAPC0603X33N]
C14  100nF  [CAPC0603X33N]
C15  100nF  [CAPC0603X33N]
C16  10uF  [CAPC2012X135N]
C17  2.2uF  [CAPC1608X90N]
C18  2.2uF  [CAPC1608X90N]
D1  BAT54  [SOT95P240X130-3N]
FB1  220R@100MHz  [INDC2012X105N]
FB2  220R@100MHz  [INDC2012X105N]
IC1  STM32F407ZGT6  [QFP50P2200X2200X160-144N]  (parts A,B of 2)
IC2  STM809SWX6F  [SOT-23]
JP1  PLHTD10S-TR-CV  [PLHTD10S-TR-CV]
JP2  1798942 (goldpin 2x 2.54)  [jump]
LD9  Green  [LED_OSRAM_LGL29K]  (value not drawn)
LD10  Green  [LED_OSRAM_LGL29K]  (value not drawn)
LD11  Green  [LED_OSRAM_LGL29K]  (value not drawn)
PB1  Push Button  [PB_TYCO_FSMSM]  (value not drawn)
Q1  8MHz  [XTAL_TXC_7A]
R1  10k  [RESC1005X40N]
R2  10k  [RESC1005X40N]
R3  10k  [RESC1005X40N]
R4  10k  [RESC1005X40N]
R5  49R9  [RESC1005X40N]
R6  10k  [RESC1005X40N]
R83  0  [RESC1005X40N]
R101  2k2  [RESC1005X40N]
R102  2k2  [RESC1005X40N]
R103  2k2  [RESC1005X40N]
R112  10k  [RESC1005X40N]
R113  10k  [RESC1005X40N]

### Ports
ADC_IN[15..0] (in), ALERTn_CH[7..0] (in), EN_PWR_CH[7..0] (out), I2C_SCL (out), I2C_SDA (bidir), INT (in), LED_CS (out), LED_OEn (out), LED_SCK (out), LED_SDI (out), P2V5_REF (in), PA_CH_RESETN (out), PA_SIG_GND (bidir), PGOOD (in), PWR_CH_OVL[7..0] (in), RESETn (out), SIG_ON_CH[7..0] (out), SPI1_MISO (in), SPI1_MOSI (out), SPI1_NSS (out), SPI1_SCK (out), SWN1 (bidir), SWN2 (bidir), USB_DM (bidir), USB_DP (bidir), USB_ID (in), USB_VBUS (in)

### Nets
GND: C1.2 C2.2 C3.2 C4.2 C5.2 C6.2 C7.2 C8.2 C9.2 C10.2 C11.2 C12.2 C13.2 C14.2 C15.2 C16.2 C17.1 C18.1 IC1.16(VSS) IC1.31(VSSA) IC1.38(VSS) IC1.51(VSS) IC1.61(VSS) IC1.83(VSS) IC1.94(VSS) IC1.107(VSS) IC1.120(VSS) IC1.130(VSS) IC2.1(Vss) JP1.3 JP1.5 LD9.1(C) LD10.1(C) LD11.1(C) PB1.2 R2.1 R4.2 R83.1
P3V3: C5.1 C6.1 C7.1 C8.1 C9.1 C10.1 C11.1 C12.1 C13.1 C14.1 C15.1 C16.1 FB1.2 IC1.17(VDD) IC1.30(VDD) IC1.39(VDD) IC1.52(VDD) IC1.62(VDD) IC1.72(VDD) IC1.84(VDD) IC1.95(VDD) IC1.108(VDD) IC1.121(VDD) IC1.131(VDD) IC1.144(VDD) IC2.3(Vcc) JP1.1 JP2.1(E1) R1.1 R5.1 R6.1 R112.2 R113.2
ADC_IN0: IC1.34(PA0-WKUP(PA0))
ADC_IN1: IC1.35(PA1)
ADC_IN2: IC1.36(PA2)
ADC_IN3: IC1.37(PA3)
ADC_IN4: IC1.18(PF6)
ADC_IN5: IC1.19(PF7)
ADC_IN6: IC1.20(PF8)
ADC_IN7: IC1.21(PF9)
ADC_IN8: IC1.22(PF10)
ADC_IN9: IC1.13(PF3)
ADC_IN10: IC1.26(PC0)
ADC_IN11: IC1.27(PC1)
ADC_IN12: IC1.28(PC2)
ADC_IN13: IC1.29(PC3)
ADC_IN14: IC1.14(PF4)
ADC_IN15: IC1.15(PF5)
ALERTn_CH0: IC1.77(PD8)  [project net ALERT]
ALERTn_CH1: IC1.78(PD9)  [project net ALERT]
ALERTn_CH2: IC1.79(PD10)  [project net ALERT]
ALERTn_CH3: IC1.80(PD11)  [project net ALERT]
ALERTn_CH4: IC1.81(PD12)  [project net ALERT]
ALERTn_CH5: IC1.82(PD13)  [project net ALERT]
ALERTn_CH6: IC1.85(PD14)  [project net ALERT]
ALERTn_CH7: IC1.86(PD15)  [project net ALERT]
EN_PWR_CH0: IC1.114(PD0)
EN_PWR_CH1: IC1.115(PD1)
EN_PWR_CH2: IC1.116(PD2)
EN_PWR_CH3: IC1.117(PD3)
EN_PWR_CH4: IC1.118(PD4)
EN_PWR_CH5: IC1.119(PD5)
EN_PWR_CH6: IC1.122(PD6)
EN_PWR_CH7: IC1.123(PD7)
I2C_SCL: IC1.136(PB6) ; port I2C_SCL
I2C_SDA: IC1.137(PB7) ; port I2C_SDA
LED1: IC1.98(PC8) R101.1
LED2: IC1.99(PC9) R102.1
LED3: IC1.111(PC10) R103.1
P2V5_REF: FB2.2 ; port P2V5_REF
PA_CH_RESETn: IC1.140(PB9) ; port PA_CH_RESETN
PA_SIG_GND: R83.2 ; port PA_SIG_GND
PWR_CH_OVL0: IC1.59(PE8)  [project net Input_overdrive]
PWR_CH_OVL1: IC1.60(PE9)  [project net Input_overdrive]
PWR_CH_OVL2: IC1.63(PE10)  [project net Input_overdrive]
PWR_CH_OVL3: IC1.64(PE11)  [project net Input_overdrive]
PWR_CH_OVL4: IC1.65(PE12)  [project net Input_overdrive]
PWR_CH_OVL5: IC1.66(PE13)  [project net Input_overdrive]
PWR_CH_OVL6: IC1.67(PE14)  [project net Input_overdrive]
PWR_CH_OVL7: IC1.68(PE15)  [project net Input_overdrive]
RST: D1.1(A) IC1.25(NRST) IC1.134(PB4(NJTRST)) JP1.10 PB1.1 R6.2
SIG_ON_CH0: IC1.93(PG8)
SIG_ON_CH1: IC1.124(PG9)
SIG_ON_CH2: IC1.125(PG10)
SIG_ON_CH3: IC1.126(PG11)
SIG_ON_CH4: IC1.127(PG12)
SIG_ON_CH5: IC1.128(PG13)
SIG_ON_CH6: IC1.129(PG14)
SIG_ON_CH7: IC1.132(PG15)
SWCLK: IC1.109(PA14(JTCK-SWCLK)) JP1.4
SWDIO: IC1.105(PA13(JTMS-SWDIO)) JP1.2
SWn1: IC1.54(PF14) R112.1 ; port SWN1
SWn2: IC1.55(PF15) R113.1 ; port SWN2
TDI: IC1.110(PA15(JTDI)) JP1.8 R1.2
TDO: IC1.133(PB3(JTDO/TRACESWO)) JP1.6
NetC1_1: C1.1 FB1.1 IC1.33(VDDA)
NetC2_1: C2.1 FB2.1 IC1.32(VREF+)
NetC3_1: C3.1 IC1.23(PH0-OSC_IN(PH0)) Q1.1(OSC1)
NetC4_1: C4.1 IC1.24(PH1-OSC_OUT(PH1)) Q1.2(OSC2)
NetC17_2: C17.2 IC1.106(VCAP_2)
NetC18_2: C18.2 IC1.71(VCAP_1)
NetD1_3: D1.3(C) IC2.2(~{RST})
NetD2_1_1: IC1.89(PG4) ; port PGOOD
NetIC1_40: IC1.40(PA4) ; port SPI1_NSS
NetIC1_41: IC1.41(PA5) ; port SPI1_SCK
NetIC1_42: IC1.42(PA6) ; port SPI1_MISO
NetIC1_43: IC1.43(PA7) ; port SPI1_MOSI
NetIC1_48: IC1.48(PB2-BOOT1(PB2)) R2.2
NetIC1_73: IC1.73(PB12) ; port LED_CS
NetIC1_74: IC1.74(PB13) ; port LED_SCK
NetIC1_76: IC1.76(PB15) ; port LED_SDI
NetIC1_90: IC1.90(PG5) ; port RESETn
NetIC1_91: IC1.91(PG6) ; port INT
NetIC1_101: IC1.101(PA9) R3.1
NetIC1_102: IC1.102(PA10) ; port USB_ID
NetIC1_103: IC1.103(PA11) ; port USB_DM
NetIC1_104: IC1.104(PA12) ; port USB_DP
NetIC1_138: IC1.138(BOOT0/VPP) JP2.2(E2) R4.1
NetIC1_139: IC1.139(PB8) ; port LED_OEn
NetIC1_143: IC1.143(PDR_ON) R5.2
NetJ2_26: R3.2 ; port USB_VBUS
NetLD9_2: LD9.2(A) R101.2
NetLD10_2: LD10.2(A) R102.2
NetLD11_2: LD11.2(A) R103.2

Not connected (* = marked no-connect by the designer): IC1 1(PE2) 2(PE3) 3(PE4) 4(PE5) 5(PE6) 6(VBAT) 7(PC13) 8(PC14-OSC32_IN(PC14)) 9(PC15-OSC32_OUT(PC15)) 10(PF0) 11(PF1) 12(PF2) 44(PC4) 45(PC5) 46(PB0) 47(PB1) 49(PF11) 50(PF12) 53(PF13) 56(PG0) 57(PG1) 58(PE7) 69(PB10) 70(PB11) 75(PB14) 87(PG2) 88(PG3) 92(PG7) 96(PC6) 97(PC7) 100(PA8) 112(PC11) 113(PC12) 135(PB5) 141(PE0) 142(PE1); JP1 7 9

### Buses and harness runs
bus ADC_IN[15..0] = port ADC_IN[15..0]
bus ALERTn_CH[7..0] = port ALERTn_CH[7..0]
bus EN_PWR_CH[7..0] = port EN_PWR_CH[7..0]
bus PWR_CH_OVL[7..0] = port PWR_CH_OVL[7..0]
bus SIG_ON_CH[7..0] = port SIG_ON_CH[7..0]

### Notes on the sheet
- (near JP1) Sprawdzic pinout czy zgodny z programatorem
- (near R2) BOOT1
- (near JP2) DFU boot enable
- fast interrupts??
- Project/Equipment
- Document
- Designer
- Drawn by
- Check.by
- File
- Last Mod.
- Print Date
- Sheet
- Size
- A3
- of
- Rev
- (in symbol R0402_2K2_1%_0.0625W_100PPM) 1%
- (in symbol R0402_10K_1%_0.0625W_100PPM) 1%
- (in symbol R0402_49R9_1%_0.0625W_100PPM) 1%

### Library data of the parts
C1 C2 C5-C9 C11-C15 = CC0201_100NF_6.3V_10%_X5R: as C62 on sheet PA_CTRL_TOP; Part Number: CC0201_100NF_6.3V_10%_X5R; Component Kind: Standard; Component Type: Standard; Pin Count: 2; Value: 100nF; Status: Not Recommended; Manufacturer Part Number: CC0201_100NF_6.3V_10%_X5R; Case: 0201; Mounted: Yes; Socket: No; SMD: Yes; Manufacturer1 Example: AVX; Manufacturer1 ComponentHeight: 0.33mm; HelpURL: \\cern.ch\dfs\Applications\Altium\Datasheets\CC0201_X5R_AVX.pdf; Author: CERN DEM JLC; CreateDate: 2007-12-03; LatestRevisionDate: 2007-12-03
C3 C4 = CC0402_12PF_50V_5%_C0G: Non-polarised capacitor; Part Description: SMD Multilayer Chip Ceramic Capacitor; Manufacturer: GENERIC; Manufacturer1 Part Number: C0402C120J5GACTU; Voltage: 50V; TC: C0G/NP0; Tolerance: ±5%; Part Number: CC0402_12PF_50V_5%_C0G; Component Kind: Standard; Component Type: Standard; Pin Count: 2; Value: 12pF; Status: Preferred; Manufacturer Part Number: CC0402_12PF_50V_5%_C0G; Case: 0402; Mounted: Yes; Socket: No; SMD: Yes; Sense: No; Manufacturer1 Example: KEMET; Manufacturer1 ComponentHeight: 0.55mm; HelpURL: \\cern.ch\dfs\Applications\Altium\Datasheets\CC0805_C0G_KEMET_(Commercial Grade).pdf; Author: CERN DEM JLC; CreateDate: 04.10.2016; LatestRevisionDate: 04.10.2016
C10 C16 = CC0805_10UF_10V_10%_X7R: as C26 on sheet ETH_IFC; Part Number: CC0805_10UF_10V_10%_X7R; Component Kind: Standard; Component Type: Standard; Pin Count: 2; Value: 10uF; Status: Preferred; Manufacturer Part Number: CC0805_10UF_10V_10%_X7R; Case: 0805; Mounted: Yes; Socket: No; SMD: Yes; Manufacturer1 Example: MURATA; Manufacturer1 ComponentHeight: 1.35mm; HelpURL: \\cern.ch\dfs\Applications\Altium\Datasheets\CC0805_X7R_MURATA.pdf; Author: CERN DEM JLC; CreateDate: 2012-04-30; LatestRevisionDate: 2012-04-30
C17 C18 = CC0603_2.2UF_10V_20%_X7R: Non-polarised capacitor; Part Description: SMD Multilayer Chip Ceramic Capacitor; Manufacturer: GENERIC; Manufacturer1 Part Number: LMK107B7225MA-T; Voltage: 10V; TC: X7R; Tolerance: ±20%; Part Number: CC0603_2.2UF_10V_20%_X7R; Component Kind: Standard; Component Type: Standard; Pin Count: 2; Value: 2.2uF; Status: Not Recommended; Manufacturer Part Number: CC0603_2.2UF_10V_20%_X7R; Case: 0603; Mounted: Yes; Socket: No; SMD: Yes; Sense: No; Manufacturer1 Example: TAIYO YUDEN; Manufacturer1 ComponentHeight: 0.9mm; HelpURL: \\cern.ch\dfs\Applications\Altium\Datasheets\CC0603_X7R_TAIYO-YUDEN_HIGH-VALUE.pdf; Author: CERN DEM JLC; CreateDate: 22.06.2011; LatestRevisionDate: 27.06.2011
D1 = BAT54: Diode Schottky  Anode Pin 1 Cathode Pin 3 (Pas de pin 2); Part Description: Single Small Signal Schottky Diode; Manufacturer: FAIRCHILD SEMICONDUCTOR; Voltage: 30V; Power: 200mA; Table: Diodes; Part Number: BAT54; Component Kind: Standard; Component Type: Standard; Device: BAT54; PackageDescription: SOT23 3-Leads, Pitch 0.95mm - Body 1.3x2.9mm, IPC Medium Density; Manufacturer Part Number: BAT54; Pin Count: 3; Case: SOT23-3; Mounted: Yes; Socket: No; SMD: Yes; ComponentHeight: 1.30mm; HelpURL: \\cern.ch\dfs\Applications\Altium\Datasheets\BAT54.pdf; Author: CERN DEM JLC; CreateDate: 2009-09-17; LatestRevisionDate: 2010-05-27
FB1 FB2 = IND0805_MURATA_BLM21PG221SN1D: as FB4 on sheet PA_CTRL_TOP; Part Number: IND0805_MURATA_BLM21PG221SN1D; Component Kind: Standard; Component Type: Standard; Pin Count: 2; Value: 220R@100MHz; Status: None; Manufacturer Part Number: BLM21PG221SN1D; Case: 0805; Mounted: Yes; Socket: No; SMD: Yes; ComponentHeight: 1.05mm; HelpURL: \\cern.ch\dfs\Applications\Altium\Datasheets\IND0402_MURATA_BLM21P.pdf; Author: CERN DEM JLC; CreateDate: 2010-01-25; LatestRevisionDate: 2010-01-25
IC1 = STM32F407ZGT6: ARM Cortex-M4 32-bit MCU+FPU, 210 DMIPS, 1024 kB Flash, 192 kB Internal RAM, 114 I/Os, 144-pin LQFP, -40 to 85 degC, Tray; Part Description: ARM Cortex-M4 32b MCU+FPU, 210DMIP, 1024 kB Flash, 192+4 kB RAM, Camera, 114 I/Os, 144-pin LQFP, Industrial Grade; Manufacturer: ST MICROELECTRONICS; PressFit: No; Bonding: No; Part Number: STM32F407ZGT6; Component Kind: Standard; Component Type: Standard; Device: STM32F407ZGT6; PackageDescription: QFP, 0.50mm Pitch, Square; 144 Pin, 20.00mm L X 20.00mm W X 1.60mm H Body, IPC Medium Density; Manufacturer Part Number: STM32F407ZGT6; Pin Count: 144; Case: QFP144; Mounted: Yes; Socket: No; SMD: Yes; Sense: No; ComponentHeight: 1.6mm; HelpURL: \\cern.ch\dfs\Applications\Altium\Datasheets\STM32F407ZGT6.pdf; Author: CERN DEM MR; CreateDate: 14.07.2016; LatestRevisionDate: 14.07.2016
IC2 = VMON_STM809: 2.93V  Reset circuit
JP1 = CON_2x5 1.27 SMT Male: 1.27 mm dual row goldpin (Maritex)
JP2 = JUMPER: Supplier 1: Farnell; Supplier Part Number 1: 1798942
LD9-LD11 = LED_OSRAM_LG L29K-G2J1-24-Z: LED Green 1C 2A; Part Description: Surface Mount Green LED (0603 Case); Manufacturer: OSRAM; PressFit: No; Bonding: No; Part Number: LED_OSRAM_LG L29K-G2J1-24-Z; Component Kind: Standard; Component Type: Standard; Color: Green; PackageDescription: Green Chip LED, 2-Leads, Body 1.7x0.8mm, IPC Medium Density; Manufacturer Part Number: LG L29K-G2J1-24-Z; Pin Count: 2; Case: 0603; Mounted: Yes; Socket: No; SMD: Yes; Sense: No; ComponentHeight: 0.67mm; HelpURL: \\cern.ch\dfs\Applications\Altium\Datasheets\LED_OSRAM_LGL29K.pdf; Author: CERN DEM JLC; CreateDate: 24.04.2012; LatestRevisionDate: 24.04.2012
PB1 = PB_TYCO_FSMSM: Push-Button Switch SPDT; Part Description: 12VDC 50mA SPST Tactile  Push-Button Switch; Manufacturer: TYCO ELECTRONICS; Manufacturer Part Number: FSMSM or 1437566-3; PressFit: No; Part Number: PB_TYCO_FSMSM; Component Kind: Standard; Component Type: Standard; Pin Count: 2; PackageDescription: Body 3.5x6.0mm, Pushbutton Switch,  TYCO ALCOSWITCH FSMSM Serie; Family: Push Button; Mounted: Yes; Socket: No; SMD: Yes; Sense: No; Status: None; ComponentHeight: 4.3mm; HelpURL: \\cern.ch\dfs\Applications\Altium\Datasheets\PB_TYCO_FSMSM.pdf; Author: CERN DEM JLC; CreateDate: 30.06.2008; LatestRevisionDate: 21.06.2012
Q1 = XTAL_8MHZ_TXC_7A-8.000MAAE-T: Quartz Crystal; Part Description: Tolerance: ±30ppm, Stability: ±30ppm, -20°C to +70°C, 12pF, SMD Glass Seam Sealing Crystal, 7A Series; Manufacturer: TXC CORPORATION; PressFit: No; Bonding: No; Part Number: XTAL_8MHZ_TXC_7A-8.000MAAE-T; Component Kind: Standard; Component Type: Standard; PackageDescription: 2 Pins, 3.2x5mm, SMD Glass Seam Sealing Crystal, 7A Serie; Value: 8MHz; Manufacturer Part Number: 7A-8.000MAAE-T; Pin Count: 2; Mounted: Yes; Socket: No; SMD: Yes; Sense: No; ComponentHeight: 1.2mm; HelpURL: \\cern.ch\dfs\Applications\Altium\Datasheets\XTAL_TXC_7A.pdf; Author: CERN DEM JLC; CreateDate: 09.10.2014; LatestRevisionDate: 12.11.2014
R1-R4 R6 R112 R113 = R0402_10K_1%_0.0625W_100PPM: Resistor - 1%; Part Description: General Purpose Thick Film Chip Resistor; Manufacturer: GENERIC; Manufacturer1 Part Number: 232270671003L; TC: ±100ppm/°C; Table: Resistors SMD; Part Number: R0402_10K_1%_0.0625W_100PPM; Component Kind: Standard; Component Type: Standard; Pin Count: 2; Value: 10k; Status: Not recommended; Power: 0.0625W; Tolerance: ±1%; Manufacturer Part Number: R0402_10K_1%_0.0625W_100PPM; Case: 0402; Mounted: Yes; Socket: No; SMD: Yes; Manufacturer1 Example: YAGEO PHYCOMP; Manufacturer1 ComponentHeight: 0.4mm; HelpURL: \\cern.ch\dfs\Applications\Altium\Datasheets\R0402_Phycomp_RC0402.pdf; Author: CERN DEM JLC; CreateDate: 2007-12-03; LatestRevisionDate: 2012-10-17
R5 = R0402_49R9_1%_0.0625W_100PPM: as R7 on sheet ETH_IFC; Part Number: R0402_49R9_1%_0.0625W_100PPM; Component Kind: Standard; Component Type: Standard; Pin Count: 2; Value: 49R9; Status: Not recommended; Power: 0.0625W; Tolerance: ±1%; Manufacturer Part Number: R0402_49R9_1%_0.0625W_100PPM; Case: 0402; Mounted: Yes; Socket: No; SMD: Yes; Manufacturer1 Example: YAGEO PHYCOMP; Manufacturer1 ComponentHeight: 0.4mm; HelpURL: \\cern.ch\dfs\Applications\Altium\Datasheets\R0402_Phycomp_RC0402.pdf; Author: CERN DEM JLC; CreateDate: 2012-10-24; LatestRevisionDate: 2012-10-24
R83 = R0402_0R_JUMPER: as R66 on sheet PA_CTRL_TOP; Part Number: R0402_0R_JUMPER; Component Kind: Standard; Component Type: Standard; Pin Count: 2; Value: 0; Status: Not recommended; Manufacturer Part Number: R0402_0R_JUMPER; Case: 0402; Mounted: Yes; Sense: No; Socket: No; SMD: Yes; Manufacturer1 Example: YAGEO PHYCOMP; Manufacturer1 ComponentHeight: 0.4mm; HelpURL: \\cern.ch\dfs\Applications\Altium\Datasheets\R0402_Phycomp_RC0402.pdf; Author: CERN DEM JLC; CreateDate: 03.12.2007; LatestRevisionDate: 17.10.2012
R101-R103 = R0402_2K2_1%_0.0625W_100PPM: as R60 on sheet PA_CTRL_TOP; Part Number: R0402_2K2_1%_0.0625W_100PPM; Component Kind: Standard; Component Type: Standard; Pin Count: 2; Value: 2k2; Status: Not recommended; Power: 0.0625W; Tolerance: ±1%; Manufacturer Part Number: R0402_2K2_1%_0.0625W_100PPM; Case: 0402; Mounted: Yes; Sense: No; Socket: No; SMD: Yes; Manufacturer1 Example: YAGEO PHYCOMP; Manufacturer1 ComponentHeight: 0.4mm; HelpURL: \\cern.ch\dfs\Applications\Altium\Datasheets\R0402_Phycomp_RC0402.pdf; Author: CERN DEM JLC; CreateDate: 03.12.2007; LatestRevisionDate: 17.10.2012